# EAGLE design clock-controller (EAGLE 7.5.0)
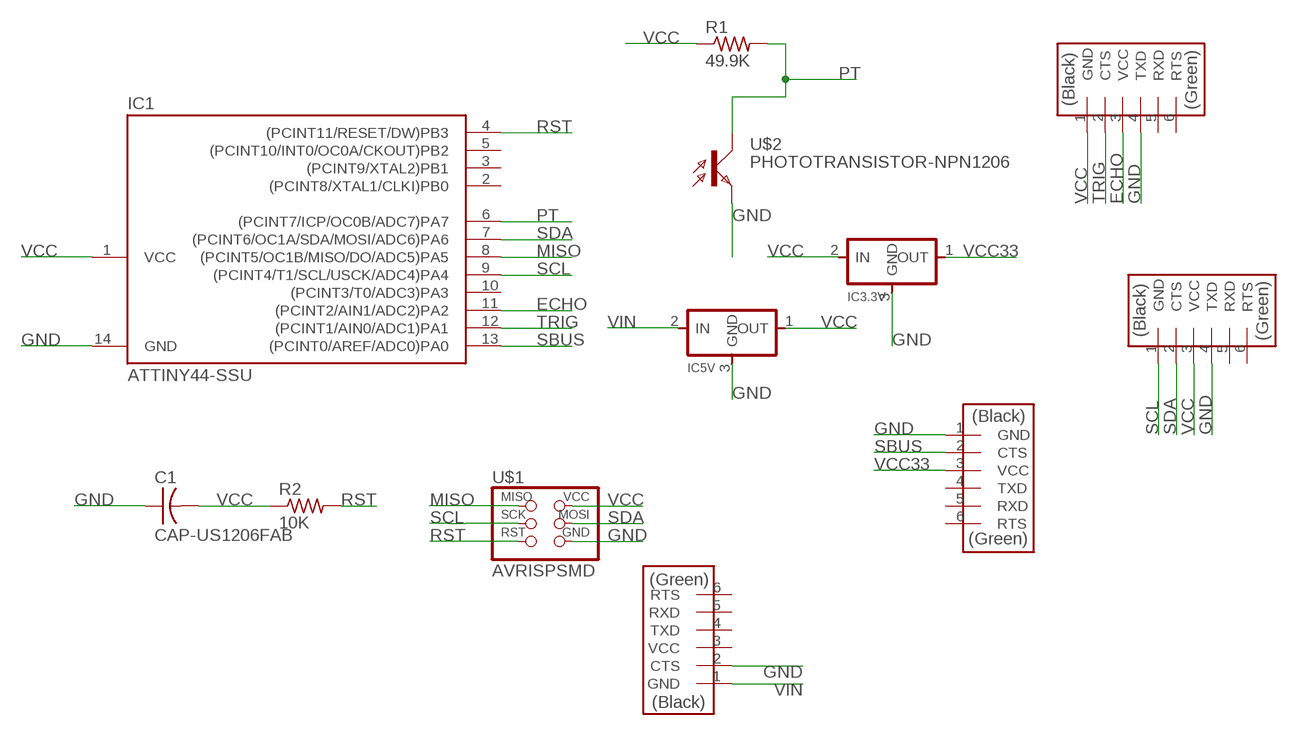
[diagram p0: schematic, sheet 1]

## Parts
C1  CAP-US1206FAB  [C1206FAB]
DIGITS  FTDI-SMD-HEADER  [1X06SMD]
IC1  ATTINY44-SSU  [SOIC14]
IC3.3V  REGULATORSOT23  [SOT23]
IC5V  REGULATORSOT23  [SOT23]
R1  49.9K  RES-US1206FAB  [R1206FAB]
R2  10K  RES-US1206FAB  [R1206FAB]
RTC  FTDI-SMD-HEADER  [1X06SMD]
U$1  AVRISPSMD  [2X03SMD]
U$2  PHOTOTRANSISTOR-NPN1206  [OP1206]
ULTRA  FTDI-SMD-HEADER  [1X06SMD]
USB  FTDI-SMD-HEADER  [1X06SMD]

## Nets
ECHO: IC1.11((PCINT2/AIN1/ADC2)PA2) ULTRA.3(VCC)
GND: C1.1 DIGITS.1(GND) IC1.14(GND) IC3.3V.3(GND) IC5V.3(GND) RTC.4(TXD) U$1.6(GND) U$2.EMITTER(E) ULTRA.4(TXD) USB.2(CTS)
MISO: IC1.8((PCINT5/OC1B/MISO/DO/ADC5)PA5) U$1.1(MISO)
PT: IC1.6((PCINT7/ICP/OC0B/ADC7)PA7) R1.2 U$2.COLLECTOR(C)
RST: IC1.4((PCINT11/RESET/DW)PB3) R2.2 U$1.5(RST)
SBUS: DIGITS.2(CTS) IC1.13((PCINT0/AREF/ADC0)PA0)
SCL: IC1.9((PCINT4/T1/SCL/USCK/ADC4)PA4) RTC.1(GND) U$1.3(SCK)
SDA: IC1.7((PCINT6/OC1A/SDA/MOSI/ADC6)PA6) RTC.2(CTS) U$1.4(MOSI)
TRIG: IC1.12((PCINT1/AIN0/ADC1)PA1) ULTRA.2(CTS)
VCC: C1.2 IC1.1(VCC) IC3.3V.2(IN) IC5V.1(OUT) R1.1 R2.1 RTC.3(VCC) U$1.2(VCC) ULTRA.1(GND)
VCC33: DIGITS.3(VCC) IC3.3V.1(OUT)
VIN: IC5V.2(IN) USB.1(GND)
Unconnected: DIGITS.4(TXD) DIGITS.5(RXD) DIGITS.6(RTS) IC1.2((PCINT8/XTAL1/CLKI)PB0) IC1.3((PCINT9/XTAL2)PB1) IC1.5((PCINT10/INT0/OC0A/CKOUT)PB2) IC1.10((PCINT3/T0/ADC3)PA3) RTC.5(RXD) RTC.6(RTS) ULTRA.5(RXD) ULTRA.6(RTS) USB.3(VCC) USB.4(TXD) USB.5(RXD) USB.6(RTS)

## Library data of the parts
C1 = fab:CAP-US
DIGITS RTC ULTRA USB = fab:FTDI-SMD-HEADER
IC1 = fab:ATTINY44
IC3.3V IC5V = fab:REGULATOR
R1 R2 = fab:RES-US: Resistor (US Symbol) Variants with postfix FAB are widened to allow the routing of internal traces
U$1 = fab:AVRISP
U$2 = fab:PHOTOTRANSISTOR-NPN

## Net classes
0 default: width 0.5 mm

## Board
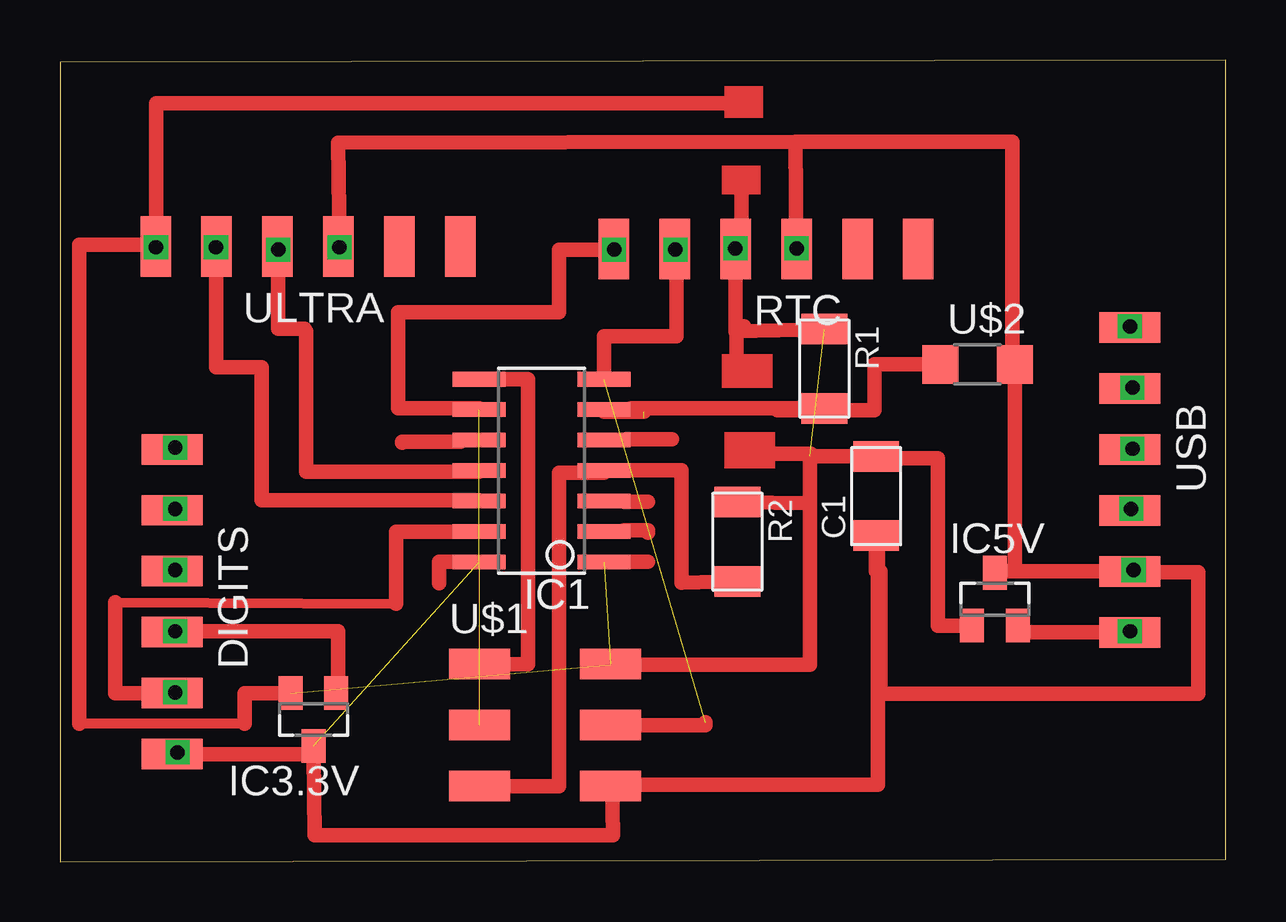
[diagram p1: board, top side]

Size 48.6 x 33.4 mm. Coordinates in mm from the lower left corner, seen from the top.
Outline: 0,0 48.6,0.1 48.6,33.4 0,33.3 0,0
Copper layers (1*16): Top 0.035mm / dielectric 1.5mm / Bottom 0.035mm
Design rules "fab": minimum track width 0.3mm, minimum drill 32mil, track to track 0.397mm, track to pad 0.397mm, pad to pad 0.397mm, via to via 0.397mm, smd to smd 0.315mm, copper to edge 40mil, drill to drill 16mil, minimum pad ring 10mil, minimum via ring 8mil, stop-mask expansion 4mil, vias tented up to drill 0mil, thermal gap 10mil

### Footprints (pad centres in the part's own frame; a part is rotated, then mirrored left to right if it is on the bottom)
C1206FAB = smd 1.27 x 1.905: 1 -1.651,0; 2 1.651,0
1X06SMD = smd 2.54 x 1.27: 1 0,6.35; 2 0,3.81; 3 0,1.27; 4 0,-1.27; 5 0,-3.81; 6 0,-6.35
SOIC14 = smd 0.61 x 2.21: 1 -3.81,-2.603; 2 -2.54,-2.603; 3 -1.27,-2.603; 4 0,-2.603; 5 1.27,-2.603; 6 2.54,-2.603; 7 3.81,-2.603; 8 3.81,2.603; 9 2.54,2.603; 10 1.27,2.603; 11 0,2.603; 12 -1.27,2.603; 13 -2.54,2.603; 14 -3.81,2.603
SOT23 = smd 1 x 1.4: 1 -0.95,-1.1; 2 0.95,-1.1; 3 0,1.1
R1206FAB = smd 1.27 x 1.905: 1 -1.651,0; 2 1.651,0
2X03SMD = smd 2.54 x 1.27: 1 -2.54,2.54; 2 2.92,2.54; 3 -2.54,0; 4 2.92,0; 5 -2.54,-2.54; 6 2.92,-2.54
OP1206 = smd 1.5 x 1.6: COLLECTOR -1.55,0; EMITTER 1.55,0

### Placement (x,y rotation side)
C1  34.02,15.23 90 top
DIGITS  4.67,10.83 180 top
IC1  20.07,16.29 90 top
IC3.3V  10.57,5.92 180 top
IC5V  38.97,10.94 0 top
R1  31.86,20.54 270 top
R2  28.24,13.33 270 top
RTC  29.43,25.52 90 top
U$1  20.02,5.69 0 top
U$2  38.25,20.71 0 top
ULTRA  10.34,25.63 90 top
USB  44.6,15.9 180 top

### Tracks (layer width: path | path; a pad name or v marks a point on that pad's centre or on a via)
ECHO  (via drill 0.6)
  Top 0.61: ULTRA.3 9.1,25.63 v9.1,25.5 9.1,22.2 10.2,22.2 10.2,22.1 10.25,22.1 10.25,16.25 17.47,16.25 IC1.11
GND  (1 unrouted)
  Top 0.61: 39.8,12.09 USB.2 44.6,12.05 47.45,12.05 47.45,7 34.2,7 34.2,12.09 34.02,12.09 C1.1 34.1,13.58 34.1,3.2 23,3.2 | IC5V.3 38.97,12.09 39.8,12.09 | 39.8,12.09 U$2.EMITTER 39.7,20.71 39.7,30 30.65,30 | 30.65,30 RTC.4 | ULTRA.4 11.65,25.63 11.6,29.95 30.65,30 | 23,3.2 22.95,3.2 U$1.6 | 23,3.2 23.05,1.1 10.62,1.1 10.57,4.48 | 10.57,4.48 IC3.3V.3 | DIGITS.1 10.57,4.48
MISO
  Top 0.61: U$1.1 19.5,8.23 19.5,20.1 IC1.8
N$3  (via drill 0.6)
  Top 0.61: 28.4,31.6 4,31.6 v4,25.6 4,25.4
N$4
  Top 0.61: 31.3,17 28.7,17 28.7,17.1
N$5
  Top 0.61: 29,17.2 29,17.4
N$6
  Top 0.61: 28.5,22.3 28.2,22.3 28.2,20.4
N$7
  Top 0.61: 28.4,25.8 28.4,28.5
N$8
  Top 0.61: 16.7,17.5 14.25,17.5 14.25,17.45
N$9
  Top 0.61: 23.6,17.6 25.5,17.6
N$10
  Top 0.61: 23.5,15 24.5,15
N$11
  Top 0.61: 23.5,13.8 24.5,13.8 24.5,13.7
N$12
  Top 0.61: 23.6,12.5 24.5,12.5
N$13
  Top 0.61: 16.8,12.5 15.8,12.5 15.8,11.6
N$14  (via drill 0.6)
  other vias: 11.65,25.6
N$15  (via drill 0.6)
  other vias: 25.65,25.5
N$16  (via drill 0.6)
  other vias: 28.15,25.55
N$17  (via drill 0.6)
  other vias: 30.7,25.55
N$18  (via drill 0.6)
  other vias: 4.8,7.05
N$19  (via drill 0.6)
  other vias: 4.9,4.55
N$20  (via drill 0.6)
  other vias: 44.6,9.6
N$21  (via drill 0.6)
  other vias: 44.75,12.15
N$22  (via drill 0.6)
  other vias: 44.7,17.2
N$23  (via drill 0.6)
  other vias: 44.7,19.75
N$24  (via drill 0.6)
  other vias: 44.6,22.3
N$25  (via drill 0.6)
  other vias: 4.8,12.15
N$26  (via drill 0.6)
  other vias: 4.8,14.7
N$27  (via drill 0.6)
  other vias: 4.8,17.25
N$28  (via drill 0.6)
  other vias: 44.65,14.7
PT  (1 unrouted)
  Top 0.61: 24.35,18.75 23.8,18.75 | 23.8,18.75 22.67,18.75 IC1.6 | U$2.COLLECTOR 33.95,20.71 33.95,18.8 29.91,18.8 R1.2 23.8,18.89 23.8,18.75
RST
  Top 0.61: R2.2 25.9,11.63 25.9,16.3 IC1.4 22.67,16.2 20.8,16.2 20.8,3.15 U$1.5
SBUS
  Top 0.406: 2.3,10.8 14,10.75
  Top 0.61: DIGITS.2 2.3,7.02 2.3,10.8 | 14,10.75 14,13.75 IC1.13
SCL  (via drill 0.6)  (1 unrouted)
  Top 0.61: RTC.1 23.2,25.52 23.2,25.5 v23.1,25.5 20.8,25.5 20.8,22.9 14.1,22.9 14.1,18.9 17.47,18.9 IC1.9
SDA  (1 unrouted)
  Top 0.61: RTC.2 25.7,25.52 25.7,21.9 22.67,21.9 IC1.7 | U$1.4 26.9,5.69 26.9,5.8
TRIG  (via drill 0.6)
  Top 0.61: ULTRA.2 6.5,25.63 v6.5,25.6 6.5,20.6 8.4,20.6 8.4,15.05 17.47,15.05 IC1.12
VCC  (3 unrouted)
  Top 0.406: 7.7,5.75 0.8,5.75
  Top 0.61: IC5V.1 36.6,9.84 36.6,16.8 34.02,16.8 C1.2 31.25,16.88 31.25,14.93 | IC3.3V.2 7.7,7.02 7.7,5.75 | 0.8,5.75 0.8,25.7 3.99,25.7 ULTRA.1 | R2.1 31.25,14.93 | 31.25,14.93 31.25,8.2 22.95,8.2 U$1.2 | R1.1 28.16,22.09 RTC.3
VCC33  (via drill 0.6)
  Top 0.61: IC3.3V.1 11.6,7.02 11.6,9.6 v4.8,9.6 4.67,9.6 DIGITS.3
VIN
  Top 0.61: USB.1 39.92,9.55 IC5V.2
(copper drawn outside any net)
  shapes: Top area x4